# Altium project Adapter.PrjPCB
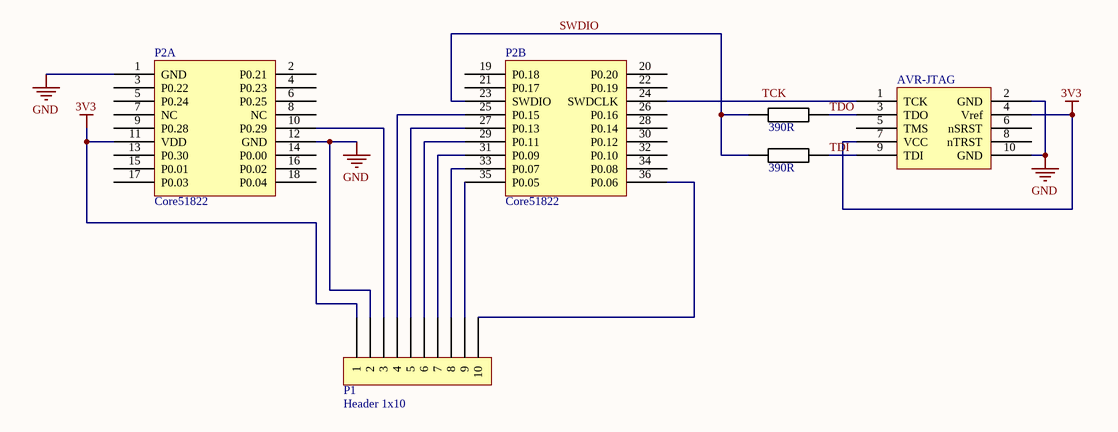
[diagram p0: Top.SchDoc]
1 sheet, 5 parts. Net scope: global (net labels, ports and power ports of the same name join across sheets).
Board file: Adapter.PcbDoc

## Sheet Top.SchDoc
size A4

### Parts
AVR-JTAG  AVR Style  [Header 2x5 IDC-10S]  (value not drawn)
P1  Header 1x10  [Header 1x10 male]
P2  Core51822  [Core51822]  (parts A,B of 2)
RH-R1  390R  [R 0805 / 2012 wide]
RH-R2  390R  [R 0805 / 2012 wide]

### Nets
3V3: AVR-JTAG.4(Vref) AVR-JTAG.7(VCC) P1.1 P2.11(VDD)
GND: AVR-JTAG.2(GND) AVR-JTAG.10(GND) P1.2 P2.1(GND) P2.12(GND)
SWDIO: P2.23(SWDIO) RH-R1.2 RH-R2.2
TCK: AVR-JTAG.1(TCK) P2.24(SWDCLK)
TDI: AVR-JTAG.9(TDI) RH-R2.1
TDO: AVR-JTAG.3(TDO) RH-R1.1
NetP1_3: P1.3 P2.10(P0.29)
NetP1_4: P1.4 P2.25(P0.15)
NetP1_5: P1.5 P2.27(P0.13)
NetP1_6: P1.6 P2.29(P0.11)
NetP1_7: P1.7 P2.31(P0.09)
NetP1_8: P1.8 P2.33(P0.07)
NetP1_9: P1.9 P2.35(P0.05)
NetP1_10: P1.10 P2.36(P0.06)

Not connected (* = marked no-connect by the designer): AVR-JTAG 5(TMS) 6(nSRST) 8(nTRST); P2 2(P0.21) 3(P0.22) 4(P0.23) 5(P0.24) 6(P0.25) 7(NC) 8(NC) 9(P0.28) 13(P0.30) 14(P0.00) 15(P0.01) 16(P0.02) 17(P0.03) 18(P0.04) 19(P0.18) 20(P0.20) 21(P0.17) 22(P0.19) 26(P0.16) 28(P0.14) 30(P0.12) 32(P0.10) 34(P0.08)

### Library data of the parts
AVR-JTAG = Header JTAG AVR
P2 = Core51822_2
RH-R1 RH-R2 = Resistor